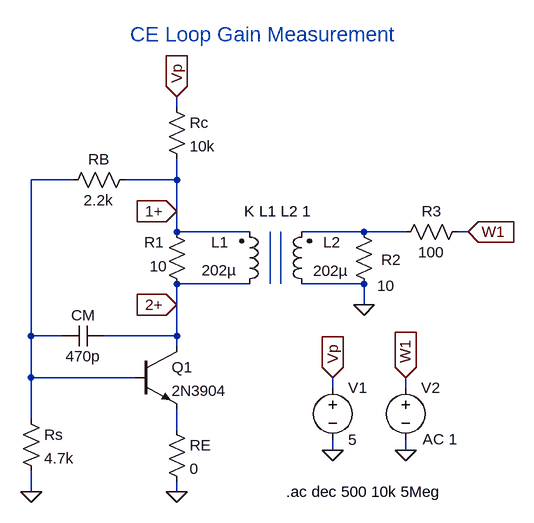
[diagram p0: schematic ce_loop_gain_ltspice.asc]
ce_loop_gain_ltspice.asc, the LTspice schematic file:
Version 4
SHEET 1 896 836
WIRE 288 192 288 176
WIRE 128 304 64 304
WIRE 288 304 288 272
WIRE 288 304 208 304
WIRE 288 352 288 304
WIRE 288 384 288 352
WIRE 400 384 288 384
WIRE 576 384 480 384
WIRE 640 384 576 384
WIRE 736 384 720 384
WIRE 400 464 288 464
WIRE 576 464 480 464
WIRE 288 496 288 464
WIRE 576 496 576 464
WIRE 64 544 64 304
WIRE 112 544 64 544
WIRE 288 544 288 496
WIRE 288 544 176 544
WIRE 288 560 288 544
WIRE 64 608 64 544
WIRE 224 608 64 608
WIRE 528 624 528 608
WIRE 640 624 640 608
WIRE 64 672 64 608
WIRE 288 688 288 656
WIRE 528 720 528 704
WIRE 640 720 640 704
WIRE 64 784 64 752
WIRE 288 784 288 768
FLAG 288 176 Vp
IOPIN 288 176 In
FLAG 736 384 W1
IOPIN 736 384 In
FLAG 576 496 0
FLAG 288 784 0
FLAG 64 784 0
FLAG 288 352 1+
IOPIN 288 352 In
FLAG 288 496 2+
IOPIN 288 496 In
FLAG 528 720 0
FLAG 640 720 0
FLAG 528 608 Vp
IOPIN 528 608 In
FLAG 640 608 W1
IOPIN 640 608 In
SYMBOL res 272 368 R0
WINDOW 0 -34 32 Left 2
WINDOW 3 -26 69 Left 2
SYMATTR InstName R1
SYMATTR Value 10
SYMBOL res 272 176 R0
SYMATTR InstName Rc
SYMATTR Value 10k
SYMBOL res 224 288 R90
WINDOW 0 0 56 VBottom 2
WINDOW 3 32 56 VTop 2
SYMATTR InstName RB
SYMATTR Value 2.2k
SYMBOL res 592 480 R180
WINDOW 0 -41 53 Left 2
WINDOW 3 -31 13 Left 2
SYMATTR InstName R2
SYMATTR Value 10
SYMBOL res 624 400 R270
WINDOW 0 32 56 VTop 2
WINDOW 3 0 56 VBottom 2
SYMATTR InstName R3
SYMATTR Value 100
SYMBOL res 272 672 R0
SYMATTR InstName RE
SYMATTR Value 0
SYMBOL res 48 656 R0
SYMATTR InstName Rs
SYMATTR Value 4.7k
SYMBOL ind2 384 480 M180
WINDOW 0 -43 80 Left 2
WINDOW 3 -58 37 Left 2
SYMATTR InstName L1
SYMATTR Value 202µ
SYMATTR Type ind
SYMBOL ind2 496 480 R180
WINDOW 0 -44 80 Left 2
WINDOW 3 -56 36 Left 2
SYMATTR InstName L2
SYMATTR Value 202µ
SYMATTR Type ind
SYMBOL cap 176 528 R90
WINDOW 0 0 32 VBottom 2
WINDOW 3 32 32 VTop 2
SYMATTR InstName CM
SYMATTR Value 470p
SYMBOL npn 224 560 R0
SYMATTR InstName Q1
SYMATTR Value 2N3904
SYMBOL voltage 528 608 R0
WINDOW 123 0 0 Left 0
WINDOW 39 0 0 Left 0
SYMATTR InstName V1
SYMATTR Value 5
SYMBOL voltage 640 608 R0
WINDOW 123 26 95 Left 2
WINDOW 39 0 0 Left 0
SYMATTR Value2 AC 1
SYMATTR InstName V2
SYMATTR Value ""
TEXT 216 80 Left 3 ;CE Loop Gain Measurement
TEXT 392 352 Left 2 !K L1 L2 1
TEXT 456 784 Left 2 !.ac dec 500 10k 5Meg
LINE Normal 432 464 432 384
LINE Normal 448 464 448 384

The netlist it stands for:
* ce_loop_gain_ltspice.asc
R1 1+ 2+ 10
Rc Vp 1+ 10k
RB 1+ N001 2.2k
R2 0 N002 10
R3 N002 W1 100
RE N003 0 0
Rs N001 0 4.7k
L1 2+ 1+ 202µ
L2 0 N002 202µ
CM 2+ N001 470p
Q1 2+ N001 N003 0 2N3904
V1 Vp 0 5
V2 W1 0 AC 1
.model NPN NPN
.model PNP PNP
.lib standard.bjt
* CE Loop Gain Measurement
K L1 L2 1
.ac dec 500 10k 5Meg
.backanno
.end